# EAGLE design R3Mkr12F_MB (EAGLE 9.0.1)
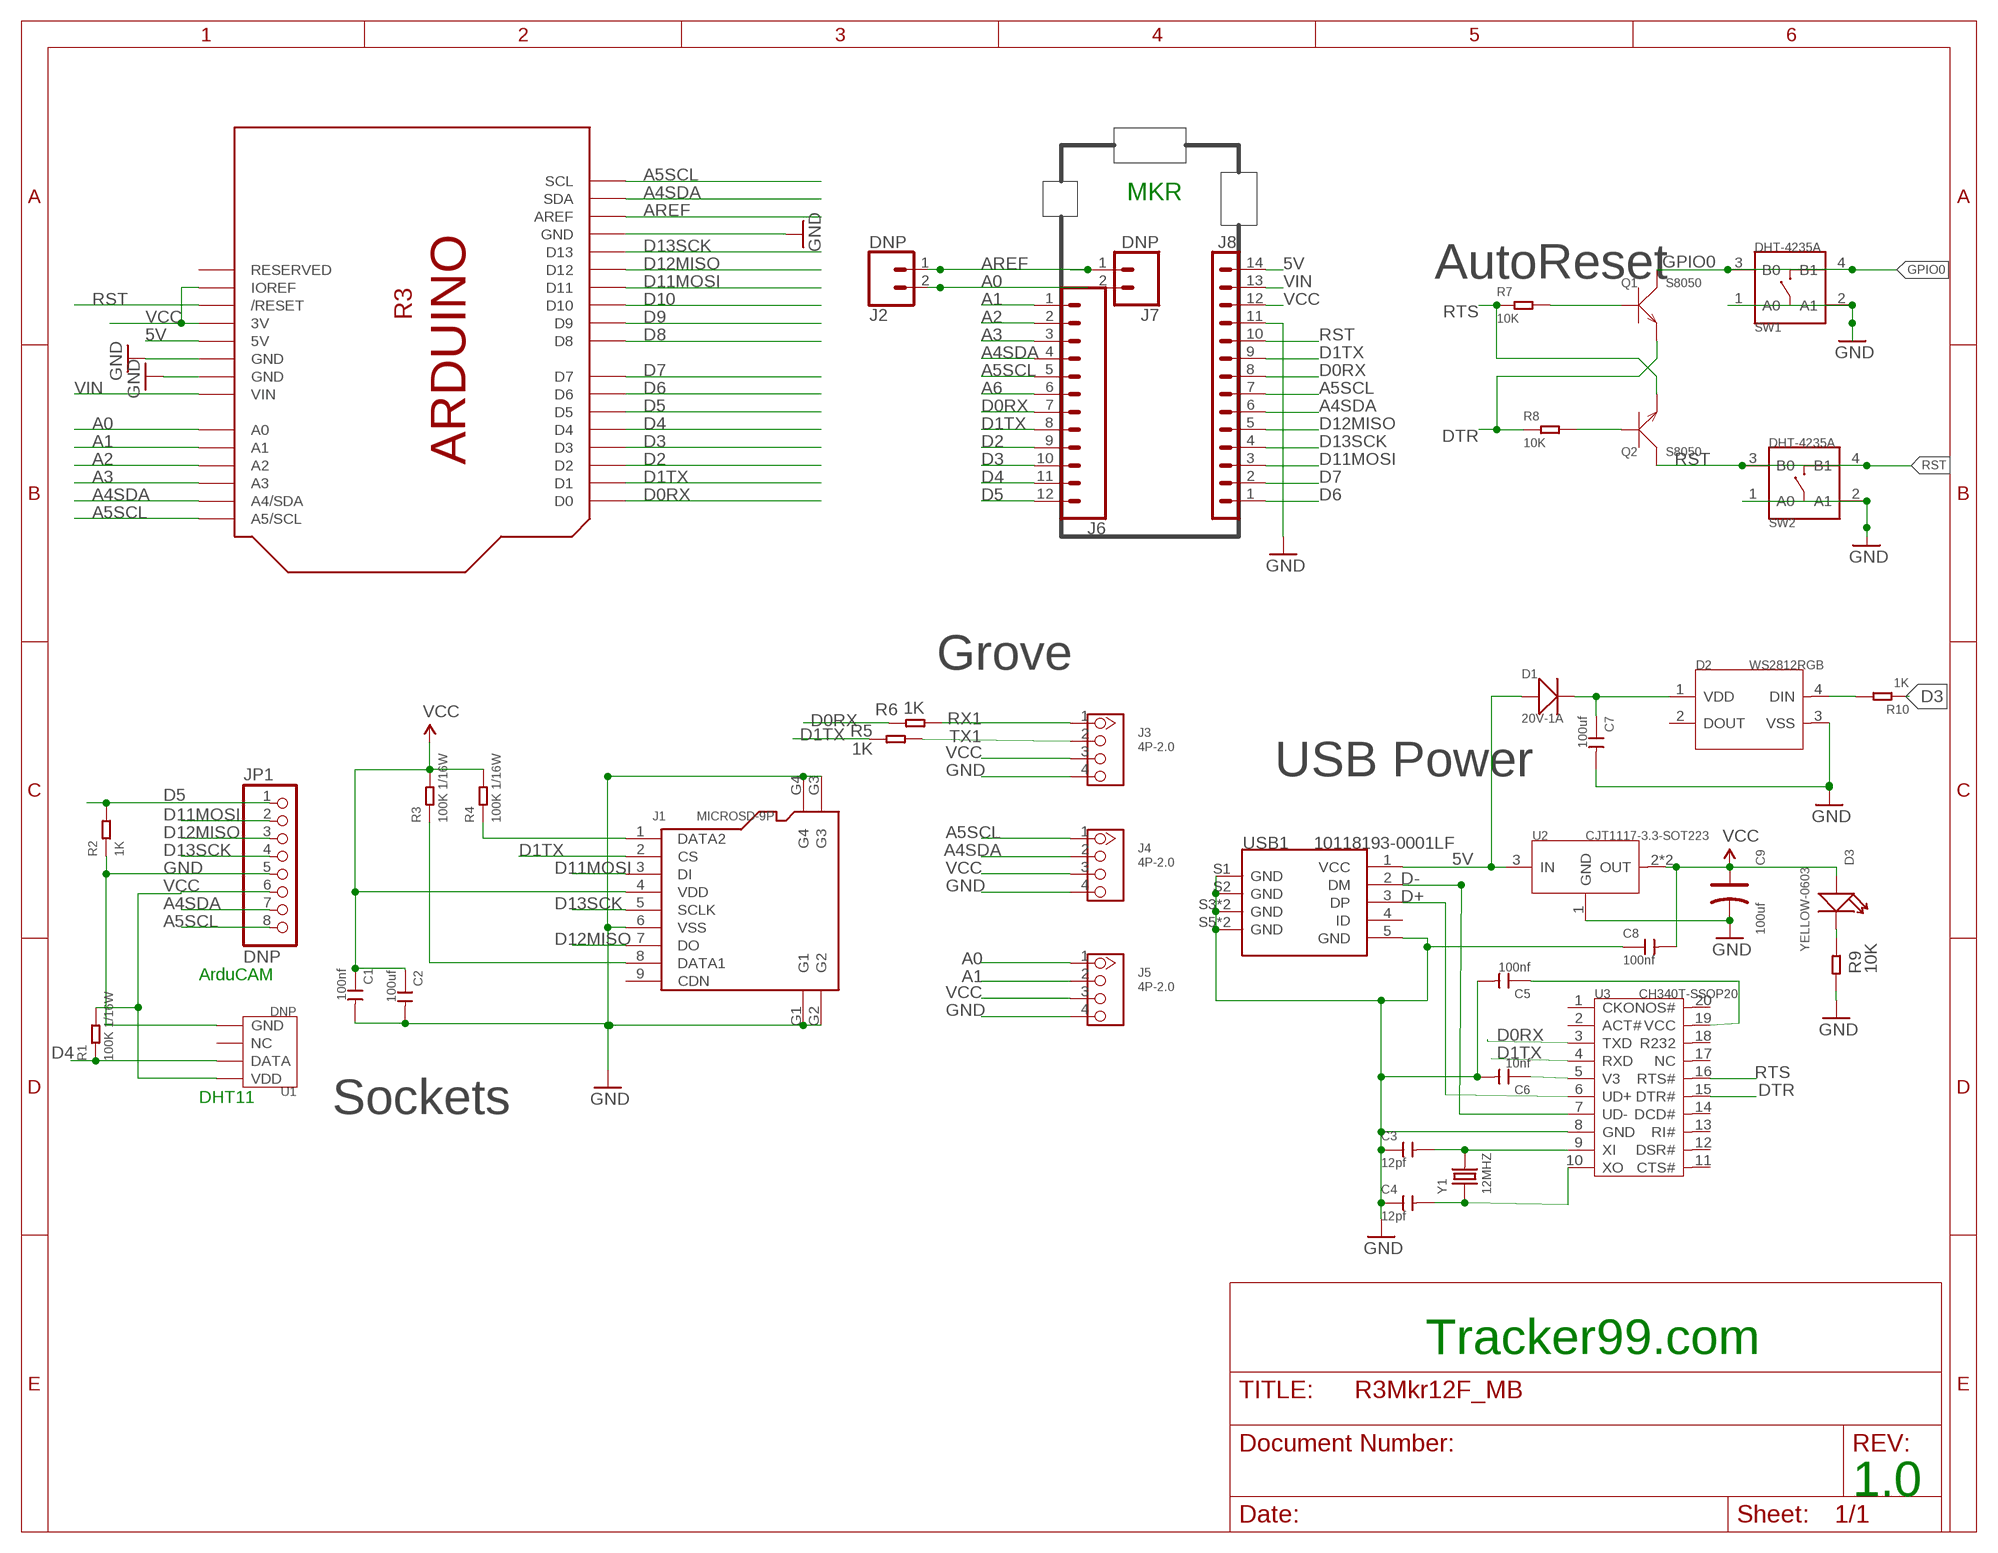
[diagram p0: schematic, sheet 1]

## Parts
C1  100nf  CERAMIC-100NF-50V-10%-X7R(0603)  [C0603]
C2  100uf  CERAMIC-100UF-6.3V-20%-X5R(1206)  [C1206]
C3  12pf  CERAMIC-12PF-50V-5%-NPO(0402)  [C0402]
C4  12pf  CERAMIC-12PF-50V-5%-NPO(0402)  [C0402]
C5  100nf  CERAMIC-100NF-50V-10%-X7R(0603)  [C0603]
C6  10nf  CERAMIC-10NF-50V-10%-X7R(0603)  [C0603]
C7  100uf  CERAMIC-100UF-6.3V-20%-X5R(1206)  [C1206]
C8  100nf  CERAMIC-100NF-50V-10%-X7R(0603)  [C0603]
C9  100uf  TANTALUM-SMD-100UF-10V(AVX-B)  [AVX-B]
D1  20V-1A  SMD-DIODE-SCHOTTKY-20V-1A(SOD-123)  [SOD-123]
D2  WS2812RGB  SMD-RGB-LED-4P'WS2812B'  [LED4-SMD-5050]
D3  YELLOW-0603  SMD-LED-CLEAR-YELLOW(0603)  [LED-0603]
J1  MICROSD-9P  MICRO-SD-CARD-HOLDER-9P  [MICRO-SD9+4P-SMD-16.1X14.5X1.85MM]
J2  DNP  CONN_02  [1X02]
J3  4P-2.0  GROVE-CONNECTOR-DIP(4P-2.0)  [HW4-2.0]
J4  4P-2.0  GROVE-CONNECTOR-DIP(4P-2.0)  [HW4-2.0]
J5  4P-2.0  GROVE-CONNECTOR-DIP(4P-2.0)  [HW4-2.0]
J6  CONN_12LOCK  [1X12_LOCK]
J7  DNP  CONN_02  [1X02]
J8  DNP  STRIP-14STD  [1X14]
JP1  DNP  MILLER_PINHD-1X8LOCK  [MILLER_1X08-LOCK]
Q1  S8050  SMD-TRANSISTORS-NPN-25V-500MW-S8050(SOT-23)  [SOT-23]
Q2  S8050  SMD-TRANSISTORS-NPN-25V-500MW-S8050(SOT-23)  [SOT-23]
R1  100K 1/16W  SMD-RES-100K-5%-1/16W(0402)  [R0402]
R2  1K  SMD-RES-1K-5%-1/8W(0805)  [R0805]
R3  100K 1/16W  SMD-RES-100K-5%-1/16W(0402)  [R0402]
R4  100K 1/16W  SMD-RES-100K-5%-1/16W(0402)  [R0402]
R5  1K  SMD-RES-1K-5%-1/8W(0805)  [R0805]
R6  1K  SMD-RES-1K-5%-1/8W(0805)  [R0805]
R7  10K  SMD-RES-10K-5%-1/(0402)  [R0402]
R8  10K  SMD-RES-10K-5%-1/(0402)  [R0402]
R9  10K  SMD-RES-10K-5%-1/(0402)  [R0402]
R10  1K  SMD-RES-1K-5%-1/8W(0805)  [R0805]
SW1  DHT-4235A  SMD-BUTTON-TOP-DHT-4235A(4P-4.2X3.2MM)  [SW4-SMD-4.2X3.2X2.5MM]
SW2  DHT-4235A  SMD-BUTTON-TOP-DHT-4235A(4P-4.2X3.2MM)  [SW4-SMD-4.2X3.2X2.5MM]
U1  DNP  TEM-HUM-DHT11(4P-15.5X12.0MM)  [SNR4-2.54-15.5X12.0X5.5MM]
U2  CJT1117-3.3-SOT223  PMIC-CJT1117-3.3(SOT223)  [SOT-223]
U3  CH340T-SSOP20  INTERFACE-CH340T(SSOP20)  [SSOP20-0.65-7.6X5.2MM]
UNO1  MKR12FUNO99_ARDUINO_R3_NOICSP_47MM  [MKR12FUNO99_ARDUINOR3_NOICSP_47MM]
USB1  10118193-0001LF  MICRO-USB-SMD-B-(10118193-0001LF)  [MICRO-USB5+6P-SMD-0.65-B]
Y1  12MHZ  SMD-CRYSTAL-12MHZ-20PF-20PPM-40R(2P-5.0X3.2MM)  [X2-SMD-5.0X3.2X1.3MM]

## Nets
5V [power]: D1.+ J8.14 U2.3(IN) UNO1.5V USB1.1(VCC)
A0: J2.2 J5.1 J7.2 UNO1.A0
A1: J5.2 J6.1 UNO1.A1
A2: J6.2 UNO1.A2
A3: J6.3 UNO1.A3
A4SDA: J4.2 J6.4 J8.6 JP1.7 UNO1.A4(A4/SDA) UNO1.SDA
A5SCL: J4.1 J6.5 J8.7 JP1.8 UNO1.A5(A5/SCL) UNO1.SCL
A6: J6.6
AREF: J2.1 J7.1 UNO1.AREF
D0RX: J6.7 J8.8 R6.2 U3.3(TXD) UNO1.D0
D1TX: J1.2(CS) J6.8 J8.9 R5.2 U3.4(RXD) UNO1.D1
D2: J6.9 UNO1.D2
D3: J6.10 R10.1 UNO1.D3
D4: J6.11 R1.1 U1.2(DATA) UNO1.D4
D5: J6.12 JP1.1 R2.2 UNO1.D5
D6: J8.1 UNO1.D6
D7: J8.2 UNO1.D7
D8: UNO1.D8
D9: UNO1.D9
D10: UNO1.D10
D11MOSI: J1.3(DI) J8.3 JP1.2 UNO1.D11
D12MISO: J1.7(DO) J8.5 JP1.3 UNO1.D12
D13SCK: J1.5(SCLK) J8.4 JP1.4 UNO1.D13
D+: U3.6(UD+) USB1.3(DP)
D-: U3.7(UD-) USB1.2(DM)
DTR: Q1.2(E) R8.1 U3.15(DTR#)
GND [power]: C1.2 C2.2 C3.1 C4.1 C5.2 C6.2 C7.2 C8.1 C9.- D2.3(VSS) J1.6(VSS) J1.G1 J1.G2 J1.G3 J1.G4 J3.4 J4.4 J5.4 J8.11 JP1.5 R2.1 R9.1 SW1.1(A0) SW1.2(A1) SW2.1(A0) SW2.2(A1) U1.4(GND) U2.1(GND) U3.8(GND) UNO1.GND UNO1.GND@1(GND) UNO1.GND@2(GND) USB1.5(GND) USB1.S1(GND) USB1.S2(GND) USB1.S3(GND) USB1.S4(GND) USB1.S5(GND) USB1.S6(GND)
GPIO0: Q1.3(C) SW1.3(B0) SW1.4(B1)
N$2 [power]: C3.2 U3.9(XI) Y1.2
N$3 [power]: C4.2 U3.10(XO) Y1.1
N$5: J1.8(DATA1) R3.1
N$6: J1.1(DATA2) R4.1
N$8: D2.4(DIN) R10.2
N$10: Q2.1(B) R8.2
N$11: Q1.1(B) R7.2
N$12: D3.- R9.2
RST: J8.10 Q2.3(C) SW2.3(B0) SW2.4(B1) UNO1.RESET(/RESET)
RTS: Q2.2(E) R7.1 U3.16(RTS#)
RX1: J3.1 R6.1
TX1: J3.2 R5.1
V1 [power]: C7.1 D1.- D2.1(VDD)
V3: C6.1 U3.5(V3)
VCC [power]: C1.1 C2.1 C5.1 C8.2 C9.+ D3.+ J1.4(VDD) J3.3 J4.3 J5.3 J8.12 JP1.6 R1.2 R3.2 R4.2 U1.1(VDD) U2.2(OUT) U2.TER(OUT) U3.19(VCC) UNO1.3V UNO1.IOREF
VIN [power]: J8.13 UNO1.VIN
Unconnected: D2.2(DOUT) J1.9(CDN) U1.3(NC) U3.1(CKO) U3.2(ACT#) U3.11(CTS#) U3.12(DSR#) U3.13(RI#) U3.14(DCD#) U3.17(NC) U3.18(R232) U3.20(NOS#) UNO1.RESERVED USB1.4(ID)

## Notes on the sheet
- MKR
- AutoReset
- Grove
- USB Power
- ArduCAM
- DHT11
- Sockets
- Tracker99.com
- 1.0

## Library data of the parts
C1 C5 C8 = Seeed-Capacitor:CERAMIC-100NF-50V-10%-X7R(0603): 302010138; MPN: CC0603KRX7R9BB104
C2 C7 = Seeed-Capacitor:CERAMIC-100UF-6.3V-20%-X5R(1206): 302010183; MPN: GRM31CR60J107ME39L
C3 C4 = Seeed-Capacitor:CERAMIC-12PF-50V-5%-NPO(0402): 302010049; MPN: CC0402JRNPO9BN120
C6 = Seeed-Capacitor:CERAMIC-10NF-50V-10%-X7R(0603): 302010140; MPN: CC0603KRX7R9BB103
C9 = Seeed-Capacitor:TANTALUM-SMD-100UF-10V(AVX-B): 302020015; MPN: TAJB107M010#NJ
D1 = Seeed-Diode:SMD-DIODE-SCHOTTKY-20V-1A(SOD-123): 304020034; MPN: B5819W
D2 = Seeed-Diode:SMD-RGB-LED-4P: 304990003
D3 = Seeed-LED:SMD-LED-CLEAR-YELLOW(0603): 304090044; MPN: 19-217-Y5C-AM1N1VY-3T
J1 = Seeed-Connector:MICRO-SD-CARD-HOLDER-9P: 320090008
J2 J7 = SparkFun-Connectors:CONN_02: Multi connection point. Often used as Generic Header-pin footprint for 0.1 inch spaced/style header connections On any of the 0.1 inch spaced packages, you can populate with these: Break Away Headers - Straight <https://www.sparkfun.com/products/116> (PRT-00116) Break Away Male Headers - Right Angle <https://www.sparkfun.com/products/553> (PRT-00553) Female Headers <https://www.sparkfun.com/products/115> (PRT-00115) Break Away Headers - Machine Pin <https://www.sparkfun.com/products/117> (PRT-00117) Break Away Female Headers - Swiss Machine Pin <https://www.sparkfun.com/products/743> (PRT-00743) For SCREWTERMINALS and SPRING TERMINALS visit here: Screw Terimnals on SparkFun.com <https://www.sparkfun.com/search/results?term=Screw+Terminals> (5mm/3.5mm/2.54mm spacing) This device is also useful as a general connection point to wire up your design to another part of your project. Our various solder wires solder well into these plated through hole pads. Hook-Up Wire - Assortment (Stranded, 22 AWG) <https://www.sparkfun.com/products/11375> (PRT-11375) Hook-Up Wire - Assortment (Solid Core, 22 AWG) <https://www.sparkfun.com/products/11367> (PRT-11367) View the entire wire category on our website here <https://www.sparkfun.com/categories/141> Special notes: Molex polarized connector foot print use with: PRT-08233 with associated crimp pins and housings. 2.54_SCREWTERM for use with PRT-10571. 3.5mm Screw Terminal footprints for PRT-08084 5mm Screw Terminal footprints for use with PRT-08432
J3-J5 = Seeed-Connector:GROVE-CONNECTOR-DIP(4P-2.0): 320110033
J6 = SparkFun-Connectors:CONN_12: Multi connection point. Often used as Generic Header-pin footprint for 0.1 inch spaced/style header connections On any of the 0.1 inch spaced packages, you can populate with these: Break Away Headers - Straight <https://www.sparkfun.com/products/116> (PRT-00116) Break Away Male Headers - Right Angle <https://www.sparkfun.com/products/553> (PRT-00553) Female Headers <https://www.sparkfun.com/products/115> (PRT-00115) Break Away Headers - Machine Pin <https://www.sparkfun.com/products/117> (PRT-00117) Break Away Female Headers - Swiss Machine Pin <https://www.sparkfun.com/products/743> (PRT-00743) For SCREWTERMINALS and SPRING TERMINALS visit here: Screw Terimnals on SparkFun.com <https://www.sparkfun.com/search/results?term=Screw+Terminals> (5mm/3.5mm/2.54mm spacing) This device is also useful as a general connection point to wire up your design to another part of your project. Our various solder wires solder well into these plated through hole pads. Hook-Up Wire - Assortment (Stranded, 22 AWG) <https://www.sparkfun.com/products/11375> (PRT-11375) Hook-Up Wire - Assortment (Solid Core, 22 AWG) <https://www.sparkfun.com/products/11367> (PRT-11367) View the entire wire category on our website here <https://www.sparkfun.com/categories/141> Special notes: Molex polarized connector foot print use with SKU : PRT-08231 with associated crimp pins and housings. 1MM SMD Version SKU: PRT-10208 NOTES ON THE VARIANTS LOCK and LOCK_LONGPADS... This footprint was designed to help hold the alignment of a through-hole component (i.e. 6-pin header) while soldering it into place. You may notice that each hole has been shifted either up or down by 0.005 of an inch from it's more standard position (which is a perfectly straight line). This slight alteration caused the pins (the squares in the middle) to touch the edges of the holes. Because they are alternating, it causes a "brace" to hold the component in place. 0.005 has proven to be the perfect amount of "off-center" position when using our standard breakaway headers. Although looks a little odd when you look at the bare footprint, once you have a header in there, the alteration is very hard to notice. Also,if you push a header all the way into place, it is covered up entirely on the bottom side.
J8 = Arduino-connectors:STRIP-14
JP1 = MKR12FUNO99:MILLER_PINHD-1X8: PIN HEADER
Q1 Q2 = Seeed-Transistor:SMD-TRANSISTORS-NPN-25V-500MW-S8050(SOT-23): 305010017; MPN: S8050
R1 R3 R4 = Seeed-Resistor:SMD-RES-100K-5%-1/16W(0402): 301010033; MPN: RC0402JR-07100KL
R2 R5 R6 R10 = Seeed-Resistor:SMD-RES-1K-5%-1/8W(0805): 301010311; MPN: RC0805JR-071KL
R7-R9 = Seeed-Resistor:SMD-RES-10K-5%-1/(0402): 301010004; MPN: RC0402JR-0710KL
SW1 SW2 = Seeed-Switch:SMD-BUTTON-TOP-DHT-4235A(4P-4.2X3.2MM): 311020045; MPN: DHT-4235A
U1 = Seeed-Sensor:TEM-HUM-DHT11(4P-15.5X12.0MM): 314010000; MPN: DHT11; VALUE: DHT11
U2 = Seeed-IC:PMIC-CJT1117-3.3(SOT223): 310030097; MPN: CJT1117-3.3
U3 = Seeed-IC:INTERFACE-CH340T(SSOP20): 310070026; MPN: CH340T
UNO1 = R3Mkr12F_MB:MKR12FUNO99_ARDUINO_R3_NOICSP_47MM: Arduino R3 NoICSP 49mm
USB1 = Seeed-Connector:MICRO-USB-SMD-B-(10118193-0001LF): 320010003; MPN: 10118193-0001LF
Y1 = Seeed-Crystal Oscillator:SMD-CRYSTAL-12MHZ-20PF-20PPM-40R(2P-5.0X3.2MM): 306010047; MPN: 5032/2P

## Net classes
0 default: width 0.152 mm, drill 0.305 mm, clearance 0.152 mm
1 power: width 0.356 mm, clearance 0.203 mm

## Board
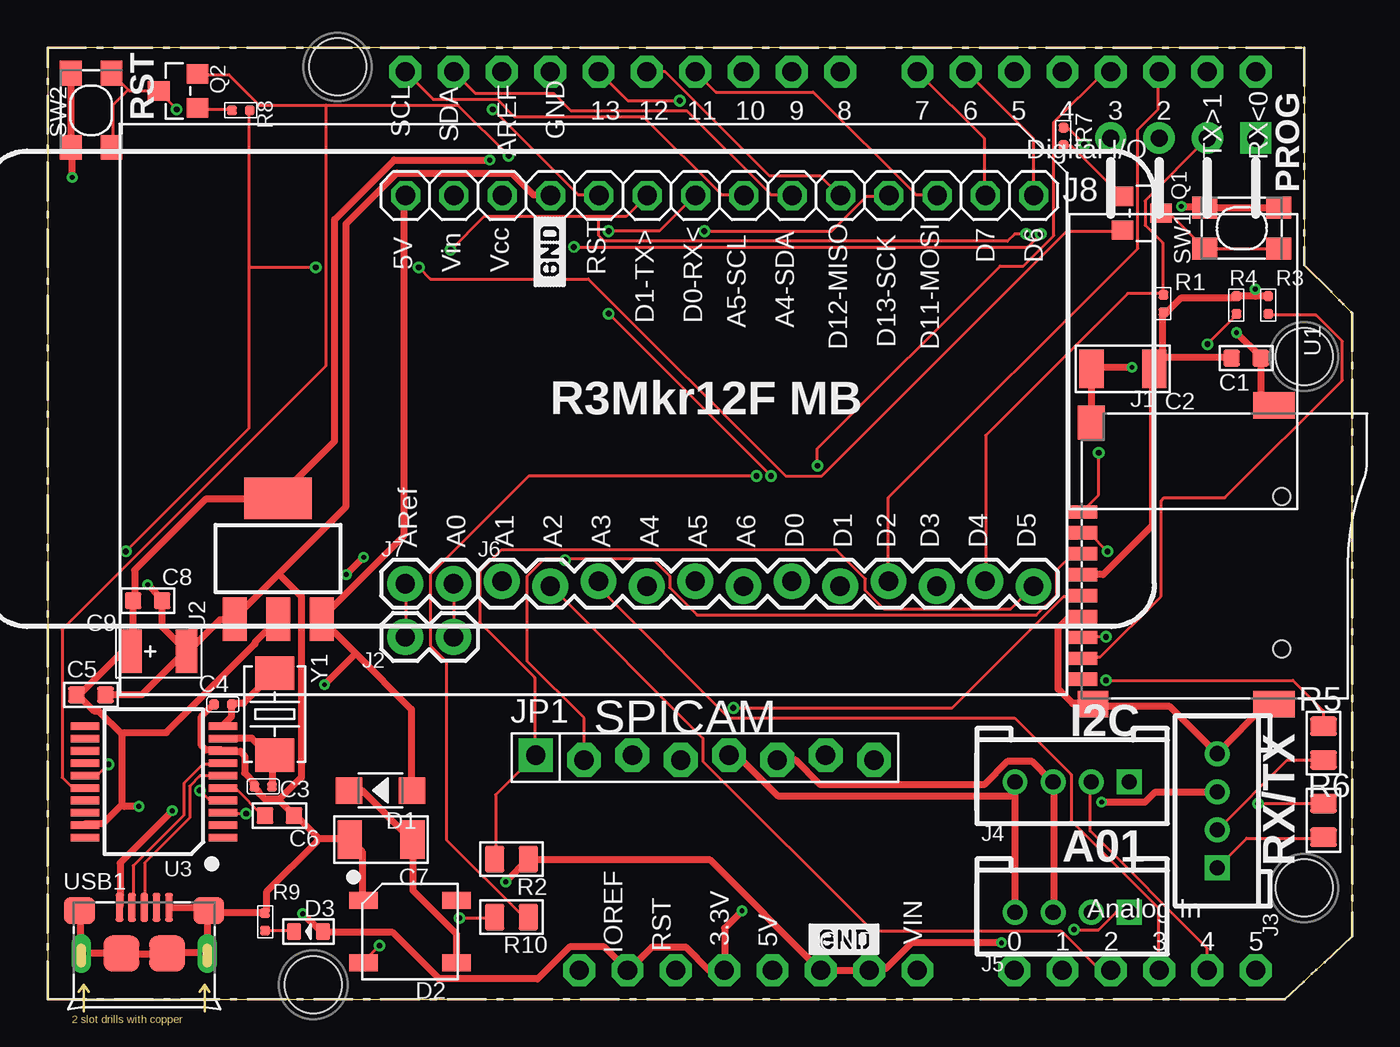
[diagram p1: board, top side]
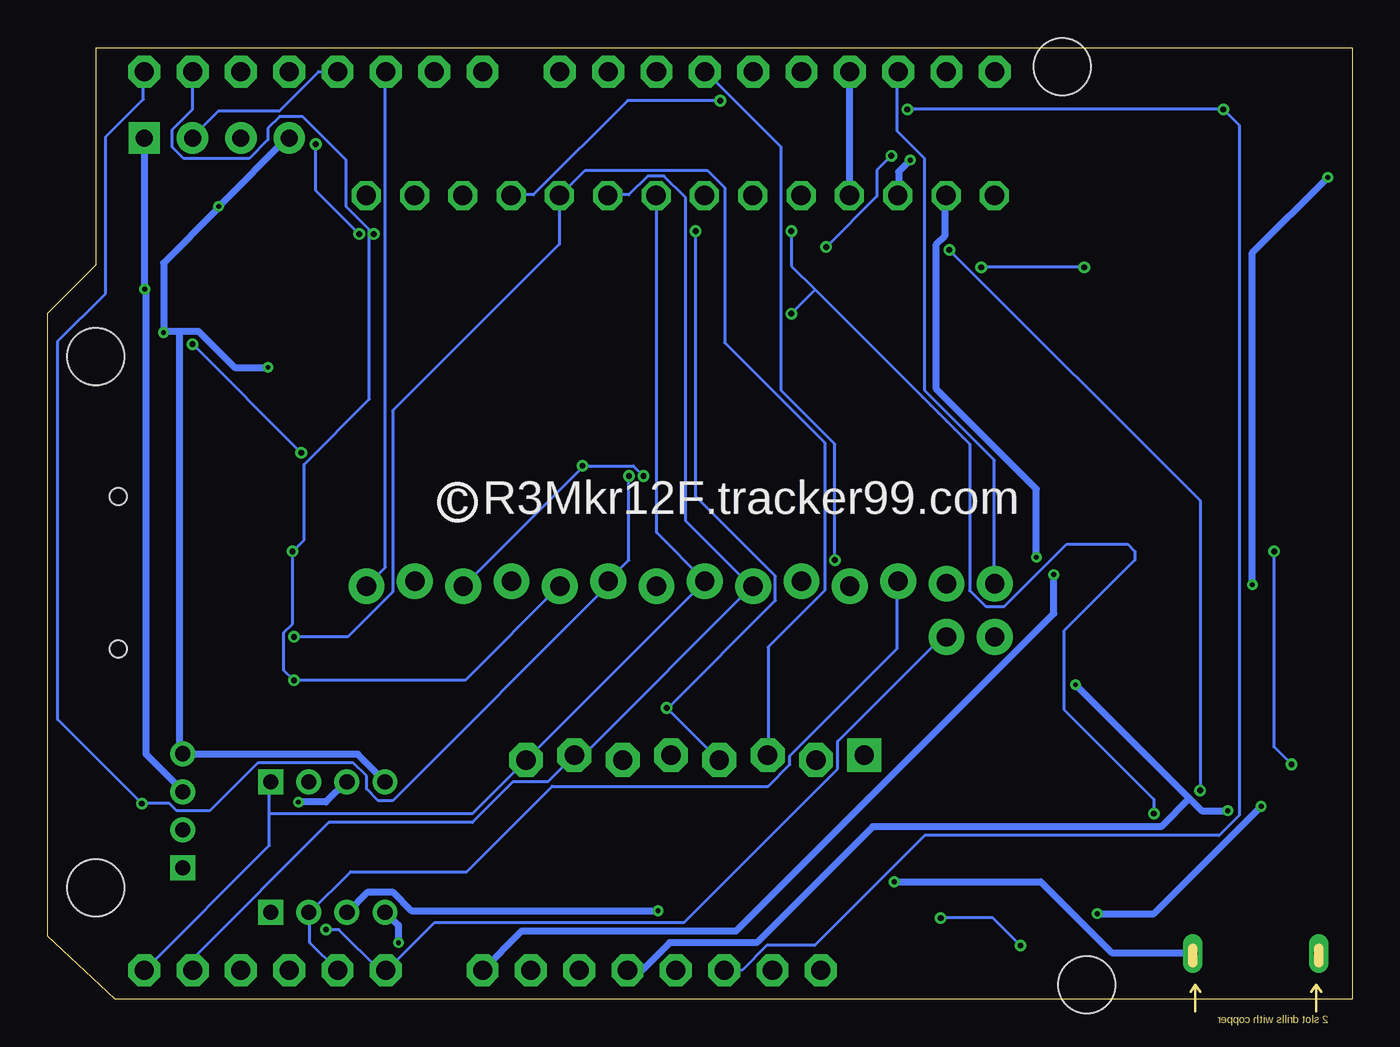
[diagram p2: board, bottom side, seen from below]

Size 68.58 x 50.04 mm. Coordinates in mm from the lower left corner, seen from the top.
Outline: 0,0 65.02,0 68.58,3.3 68.58,36.07 66.04,38.61 66.04,50.04 0,50.04 0,0
Copper layers (1*16): Top 0.035mm / dielectric 1.5mm / Bottom 0.035mm
Design rules "SeeedStudio_2layers *": minimum track width 6mil, minimum drill 10mil, track to track 6mil, track to pad 6mil, pad to pad 6mil, via to via 6mil, smd to smd 0mil, copper to edge 16mil, drill to drill 10mil, minimum pad ring 10mil, minimum via ring 6mil, stop-mask expansion 2mil, vias tented up to drill 100mil, thermal gap 10mil
tRestrict: area 0,22.6 to 3.8,40.4
bRestrict: area 0,22.4 to 3.8,40.4

### Footprints (pad centres in the part's own frame; a part is rotated, then mirrored left to right if it is on the bottom)
C0603 = smd 0.889 x 0.889: 1 0,0.762; 2 0,-0.762
C1206 = smd 1.27 x 2.032: 1 -1.651,0; 2 1.651,0
C0402 = smd 0.5 x 0.5: 1 0,0.463; 2 0,-0.463
AVX-B = smd 1.143 x 2.286: + -1.46,0; - 1.46,0
SOD-123 = smd 1.397 x 1.397: + -1.651,0; - 1.651,0
LED4-SMD-5050 = smd 1.5 x 0.9: 1 -2.45,1.65; 2 -2.45,-1.65; 3 2.45,-1.65; 4 2.45,1.65
LED-0603 = smd 0.762 x 0.889: + -0.762,0; - 0.762,0
MICRO-SD9+4P-SMD-16.1X14.5X1.85MM = smd 1.6 x 0.7: 1 0,2.25; 2 0,1.15; 3 0,0.05; 4 0,-1.05; 5 0,-2.15; 6 0,-3.25; 7 0,-4.35; 8 0,-5.45; 9 0,-6.55 | smd 1.6 x 1.4: G1 0.6,-7.85 | smd 2.2 x 1.4: G2 10.1,-7.85; G3 10.1,7.85 | smd 1.4 x 1.8: G4 0.5,6.95 | hole 0.9: 10.5,-4.95; 10.5,3.05
1X02 = drill 1.016 pad 1.88: 1 0,0; 2 2.54,0
HW4-2.0 = drill 0.8 pad 1.27 square: 1 -3,0 | drill 0.8 pad 1.27: 2 -1,0; 3 1,0; 4 3,0
1X12_LOCK = drill 1.016 pad 1.88: 1 0,0.127; 2 2.54,-0.127; 3 5.08,0.127; 4 7.62,-0.127; 5 10.16,0.127; 6 12.7,-0.127; 7 15.24,0.127; 8 17.78,-0.127; 9 20.32,0.127; 10 22.86,-0.127; 11 25.4,0.127; 12 27.94,-0.127
1X14 = drill 1.016 octagon: 1 -16.51,0; 2 -13.97,0; 3 -11.43,0; 4 -8.89,0; 5 -6.35,0; 6 -3.81,0; 7 -1.27,0; 8 1.27,0; 9 3.81,0; 10 6.35,0; 11 8.89,0; 12 11.43,0; 13 13.97,0; 14 16.51,0
MILLER_1X08-LOCK = drill 1.016 pad 1.778 square: 1 -8.89,0.127 | drill 1.016 pad 1.778 octagon: 2 -6.35,-0.127; 3 -3.81,0.127; 4 -1.27,-0.127; 5 1.27,0.127; 6 3.81,-0.127; 7 6.35,0.127; 8 8.89,-0.127
SOT-23 = smd 1.016 x 1.143: 1 -0.889,-1.016; 2 0.889,-1.016; 3 0,1.016
R0402 = smd 0.5 x 0.5: 1 0,0.463; 2 0,-0.463
R0805 = smd 1.397 x 1.016: 1 0,0.889; 2 0,-0.889
SW4-SMD-4.2X3.2X2.5MM = smd 1.3 x 1.15: 1 -1.95,1.075; 2 1.95,1.075; 3 -1.95,-1.075; 4 1.95,-1.075
SNR4-2.54-15.5X12.0X5.5MM = drill 0.889 pad 1.651 square: 1 -11.75,3.81 | drill 0.889 pad 1.651: 2 -11.75,1.27; 3 -11.75,-1.27; 4 -11.75,-3.81
SOT-223 = smd 1.27 x 2.286: 1 -2.286,-3.175; 2 0,-3.175; 3 2.286,-3.175 | smd 3.556 x 2.159: TER 0,3.175
SSOP20-0.65-7.6X5.2MM = smd 0.4 x 1.5: 1 -2.925,-3.625; 2 -2.275,-3.625; 3 -1.625,-3.625; 4 -0.975,-3.625; 5 -0.325,-3.625; 6 0.325,-3.625; 7 0.975,-3.625; 8 1.625,-3.625; 9 2.275,-3.625; 10 2.925,-3.625; 11 2.925,3.625; 12 2.275,3.625; 13 1.625,3.625; 14 0.975,3.625; 15 0.325,3.625; 16 -0.325,3.625; 17 -0.975,3.625; 18 -1.625,3.625; 19 -2.275,3.625; 20 -2.925,3.625
MKR12FUNO99_ARDUINOR3_NOICSP_47MM = drill 1 pad 1.676 octagon: 3V 35.56,3.302; 5V 38.1,3.302; A0 50.8,3.302; A1 53.34,3.302; A2 55.88,3.302; A3 58.42,3.302; A4 60.96,3.302; A5 63.5,3.302; AREF 23.876,50.546; D0 63.5,50.546; D1 60.96,50.546; D2 58.42,50.546; D3 55.88,50.546; D4 53.34,50.546; D5 50.8,50.546; D6 48.26,50.546; D7 45.72,50.546; D8 41.656,50.546; D9 39.116,50.546; D10 36.576,50.546; D11 34.036,50.546; D12 31.496,50.546; D13 28.956,50.546; GND 26.416,50.546; GND@1 43.18,3.302; GND@2 40.64,3.302; IOREF 30.48,3.302; RESERVED 27.94,3.302; RESET 33.02,3.302; SCL 18.796,50.546; SDA 21.336,50.546; VIN 45.72,3.302 | hole 3: 15.24,50.8; 13.97,2.54; 66.04,7.62; 66.04,35.56
MICRO-USB5+6P-SMD-0.65-B = smd 0.4 x 1.5: 1 -1.3,-0.25; 2 -0.65,-0.25; 3 0,-0.25; 4 0.65,-0.25; 5 1.3,-0.25 | smd 1.6 x 1.4: S1 -3.4,-0.427; S6 3.4,-0.427 | drill 0.508 pad 1.016 long: S2 -3.3,-2.675; S5 3.3,-2.675 | smd 1.9 x 1.9: S3 -1.2,-2.675; S4 1.2,-2.675
X2-SMD-5.0X3.2X1.3MM = smd 1.778 x 2.032: 1 -2.159,0; 2 2.159,0

### Placement (x,y rotation side)
C1  62.99,33.71 90 top
C2  56.52,33.15 180 top
C3  11.34,11.18 90 top
C4  9.22,15.49 90 top
C5  2.29,16 90 top
C6  12.19,9.65 90 top
C7  17.53,8.38 180 top
C8  5.26,20.95 270 top
C9  5.84,18.29 0 top
D1  17.5,10.97 180 top
D2  19.05,3.56 180 top
D3  13.72,3.56 180 top
J1  54.36,23.37 0 top
J2  18.8,19.05 0 top
J3  61.47,9.91 90 top
J4  53.85,11.43 180 top
J5  53.85,4.57 180 top
J6  23.88,21.84 0 top
J7  18.8,21.84 0 top
J8  35.32,42.26 180 top
JP1  34.54,12.7 0 top
Q1  57.51,41.33 270 top
Q2  6.86,47.75 90 top
R1  58.65,36.58 0 top
R2  24.38,7.37 270 top
R3  64.16,36.5 180 top
R4  62.48,36.5 180 top
R5  67.06,13.46 180 top
R6  67.06,9.4 180 top
R7  53.39,45.36 0 top
R8  10.16,46.74 270 top
R9  11.43,4.06 0 top
R10  24.38,4.32 270 top
SW1  62.76,40.54 0 top
SW2  2.29,46.74 90 top
U1  59.69,33.53 270 top
U2  12.12,23.16 0 top
U3  5.59,11.43 90 top
UNO1  0,-1.78 0 top
USB1  5.08,5.08 0 top
Y1  11.94,14.99 270 top

### Tracks (layer width: path | path; a pad name or v marks a point on that pad's centre or on a via)
5V  (via drill 0.25)
  Top 0.356: 16.19,18.17 14.4,19.96 U2.3 14.48,20.12 18.75,24.38 18.75,42.22 J8.14 | 16.19,18.17 19.13,15.24 19.13,10.97 D1.+ | v6.55,9.91 3.81,7.16 3.81,4.88 USB1.1 | 16.19,18.17 v14.55,16.54
  Bottom 0.356: v6.55,9.91 7.92,9.91 8.57,10.55 | v14.55,16.54 8.57,10.55 | UNO1.5V 37.34,1.52 35.89,2.97 31.32,2.97 25.22,9.07 10.06,9.07 8.57,10.55
A0  (via drill 0.3)
  Top 0.152: J7.2 J2.2 | J5.1 56.16,4.57 55.24,3.66 v53.95,3.66
  Bottom 0.152: v53.95,3.66 53.26,3.66 51.13,1.52 UNO1.A0 50.75,1.52 48.23,4.04 35.13,4.04 27.05,12.12 27.05,13.56 21.57,19.05 J2.2
A1
  Bottom 0.152: 54.79,4.57 54.79,2.97 UNO1.A1 | 54.79,4.57 52.65,6.71 46.56,6.71 42.06,11.2 30.71,11.2 29.57,12.34 29.57,12.8 23.93,18.44 23.93,21.95 J6.1 | 54.79,4.57 J5.2
A2
  Top 0.152: UNO1.A2 55.32,1.52 53.26,3.58 43.36,3.58 34.44,12.5 34.44,13.72 26.44,21.72 J6.2
A3
  Top 0.152: J6.3 28.96,21.64 35.81,14.78 50.83,14.78 53.8,11.81 53.8,9.37 58.37,4.8 58.37,1.52 UNO1.A3
A4SDA
  Top 0.152: UNO1.SDA 22.48,47.62 26.59,47.62 27.51,46.71 33.6,46.71 38.02,42.29 39.09,42.29 J8.6 | UNO1.A4 60.96,2.67 54.79,8.84 54.79,11.43 J4.2
  Bottom 0.152: UNO1.A4 60.96,2.13 53.8,9.3 46.25,9.3 44.12,11.43 42.29,11.43 JP1.7 40.84,12.88 40.39,12.88 31.55,21.72 J6.4 31.62,21.72 35.05,25.15 35.05,42.14 36.2,43.28 37.03,43.28 38.02,42.29 39.09,42.29 J8.6
A5SCL
  Top 0.152: J8.7 36.58,42.29 35.43,42.29 31.32,46.41 24.54,46.41 23.62,47.32 20.27,47.32 18.82,48.77 UNO1.SCL
  Bottom 0.152: 56.92,9.75 56.92,8.08 63.48,1.52 UNO1.A5 | 56.92,9.75 56.92,11.43 J4.1 | 56.92,9.75 46.25,9.75 JP1.8 J6.5 34.06,22.02 36.58,24.54 36.58,42.22 J8.7
AREF
  Top 0.152: J2.1 18.82,19.05 18.82,21.79 J7.1
  Bottom 0.152: UNO1.AREF 23.93,48.77 23.93,45.64 22.48,44.2 22.48,32 18.82,28.35 18.82,21.87 J7.1
D0RX  (via drill 0.3)
  Top 0.152: v10.44,9.75 9.22,9.75 U3.3 | v29.49,40.39 32.16,40.39 33.98,42.22 J8.8 | v63.63,10.29 R6.2 | v38.02,27.51 v29.49,36.04
  Bottom 0.152: v10.44,9.75 10.44,10.52 15.16,15.24 15.16,19.36 11.43,23.09 11.43,23.55 11.81,23.93 15.01,23.93 18.29,20.65 19.28,20.65 20.12,21.49 20.12,29.18 28.23,37.3 | 28.23,37.3 29.49,38.56 v29.49,40.39 | UNO1.D0 63.55,48.77 63.55,47.32 65.53,45.34 65.53,37.11 68.05,34.59 68.05,14.71 v63.63,10.29 62.18,10.29 61.8,9.91 60.05,9.91 57.53,12.42 52.5,12.42 51.82,11.73 51.82,11.05 51.21,10.44 50.44,10.44 39.17,21.72 39.17,21.95 J6.7 39.09,22.02 38.02,23.09 v38.02,27.51 | v29.49,36.04 28.23,37.3
D1TX  (via drill 0.3)
  Top 0.152: v8,10.97 8.46,10.52 9.14,10.52 U3.4 | v21.18,39.4 22.94,41.15 28.96,41.15 | 28.96,41.15 30.4,41.15 31.47,42.22 J8.9 | R5.2 67.06,15.16 65.46,16.76 v55.63,16.76 | v55.7,23.55 54.79,24.46 54.41,24.46 J1.2 | 28.96,41.15 28.96,40.16 29.26,39.85 50.44,39.85 50.83,40.23 v51.44,40.23
  Bottom 0.152: v8,10.97 8,26.21 v21.18,39.4 | J6.8 41.68,21.72 46.63,16.76 v55.63,16.76 56.16,17.3 56.16,19.28 55.7,19.74 v55.7,23.55 55.09,24.16 55.09,28.12 51.66,31.55 51.66,40.23 | UNO1.D1 60.96,46.79 62.03,45.72 62.03,44.81 61.42,44.2 57.99,44.2 57,45.19 57,45.8 56.39,46.41 55.17,46.41 52.88,44.12 52.88,41.68 51.66,40.46 51.66,40.23 | 51.66,40.23 v51.44,40.23
D2
  Top 0.152: J6.9 44.2,26.36 57.3,39.47 57.3,45.72 58.37,46.79 58.37,48.77 UNO1.D2
D3  (via drill 0.3)
  Top 0.152: v37.26,27.51 25.3,27.51 20.12,22.33 20.12,18.59 20.95,17.75 20.95,8.38 24.99,4.34 25.22,4.34 R10.1 | UNO1.D3 55.55,48.77 52.88,46.1 52.88,40.16 51.28,38.56 50.06,38.56 40.46,28.96 v40.46,28.04
  Bottom 0.152: v37.26,27.51 37.8,28.04 40.39,28.04 40.42,28 | 40.42,28 46.71,21.72 J6.10 | v40.46,28.04 40.42,28
D4
  Top 0.152: U1.2 60.96,45.26 57.68,41.99 57.68,40.69 58.6,39.78 58.6,37.11 R1.1 58.52,37.11 56.77,37.11 49.3,29.64 49.3,22.02 J6.11
  Bottom 0.152: UNO1.D4 54.33,48.77 56.39,46.71 59.59,46.71 60.96,45.34 U1.2
D5
  Top 0.152: R2.2 23.55,7.39 23.55,10.74 25.6,12.8 JP1.1 25.6,12.88 25.6,16.92 22.71,19.81 22.71,22.48 23.85,23.62 41.45,23.62 42.98,22.1 42.98,21.49 43.97,20.5 50.6,20.5 J6.12
  Bottom 0.152: J6.12 50.83,22.71 50.83,48.77 UNO1.D5
D6
  Top 0.152: J8.1 51.82,42.29 51.82,45.26 48.31,48.77 UNO1.D6
D7
  Top 0.152: UNO1.D7 49.23,45.26 49.23,42.29 J8.2
D11MOSI  (via drill 0.3)
  Top 0.152: J8.3 46.71,42.29 45.64,42.29 40.23,47.7 35.13,47.7 34.06,48.77 UNO1.D11 | 27.2,23.16 26.14,23.16 25.22,22.25 25.22,17.75 28.19,14.78 JP1.2 | 27.2,23.16 31.77,23.16 32.69,22.25 32.69,21.64 34.14,20.19 51.97,20.19 53.03,21.26 53.03,22.55 53.87,23.39 54.33,23.39 J1.3 | 27.2,23.16 v27.2,23.09
  Bottom 0.152: v27.2,23.09 27.2,29.18 30.02,32 30.02,44.81 33.98,48.77 UNO1.D11
D12MISO  (via drill 0.3)
  Top 0.152: v55.63,19.05 54.41,19.05 J1.7 | UNO1.D12 32.46,48.77 37.95,43.28 40.62,43.28 41.6,42.29 J8.5
  Bottom 0.152: v55.63,19.05 52.81,19.05 50.44,21.41 50.44,30.94 41.68,39.7 41.68,42.22 J8.5 41.6,42.29 40.31,43.59 33.91,43.59 32.99,42.67 32.99,34.52 27.74,29.26 27.74,21.49 30.71,18.52 30.71,12.88 JP1.3
D13SCK  (via drill 0.3)
  Top 0.152: v33.22,47.24 30.48,47.24 UNO1.D13 | v36.04,15.32 47.55,15.32 53.42,21.18 54.33,21.18 J1.5 | v34.52,40.39 41.22,40.39 43.05,42.22 44.2,42.22 J8.4
  Bottom 0.152: v33.22,47.24 38.1,47.24 43.05,42.29 44.2,42.29 J8.4 | JP1.4 33.3,12.57 v36.04,15.32 35.97,15.32 30.33,20.95 30.33,22.25 34.52,26.44 v34.52,40.39
D+
  Top 0.152: USB1.3 5.11,4.88 5.11,7.16 7.47,9.53 7.47,11.2 8,11.73 9.14,11.73 U3.6
D-
  Top 0.152: USB1.2 4.5,4.88 4.5,7.01 7.16,9.68 7.16,11.35 8.15,12.34 9.14,12.34 U3.7
DTR  (via drill 0.3)
  Top 0.152: 10.59,38.48 10.59,30.02 v4.12,23.55 | 10.59,38.48 10.59,46.71 R8.1 | v3.2,12.34 2.67,11.81 1.98,11.81 U3.15 | v19.51,38.48 20.12,37.87 28.42,37.87 38.79,27.51 40.69,27.51 53.57,40.39 56.46,40.39 Q1.2 | 10.59,38.48 v14.1,38.48
  Bottom 0.152: v4.12,23.55 4.12,13.26 v3.2,12.34 | v14.1,38.48 v19.51,38.48
GND  (via drill 0.25)
  Top 0.356: USB1.S1 1.75,4.65 1.75,2.44 USB1.S2 1.91,2.44 3.81,2.44 USB1.S3 4.04,2.36 6.1,2.36 USB1.S4 6.33,2.44 8.31,2.44 USB1.S5 8.38,2.59 8.38,4.5 USB1.S6 | USB1.S6 8.53,4.65 8.61,4.57 11.43,4.57 R9.1 11.51,4.72 11.51,5.64 14.17,8.31 14.25,8.46 | USB1.5 6.4,4.8 8.38,4.8 USB1.S6 | D2.3 16.54,5.26 16.54,7.77 15.93,8.38 C7.2 15.77,8.46 14.25,8.46 | 12.12,10.52 11.43,10.52 11.12,10.82 11.12,10.9 10.9,11.12 C3.1 10.9,11.35 10.36,11.89 10.36,12.8 10.13,13.03 9.37,13.03 U3.8 9.14,13.11 8.31,13.11 8.08,13.34 8.08,14.86 8.69,15.47 C4.1 | 12.12,10.52 12.95,9.68 C6.2 13.11,9.6 14.25,8.46 | SW2.2 1.22,48.62 1.22,44.81 SW2.1 1.29,44.65 v1.29,43.2 | C5.2 4.95,16 7.24,18.29 C9.- | C9.- 7.16,18.44 6.02,19.58 C8.1 5.94,21.11 v5.26,21.79 | C9.- 7.47,18.36 9.07,19.96 9.83,19.96 U2.1 9.91,20.12 12.15,22.36 | 12.15,22.36 15.7,25.91 15.7,40.77 18.36,43.43 24.38,43.43 25.53,42.29 26.36,42.29 J8.11 | 12.15,22.36 13.34,21.18 13.34,11.66 12.27,10.59 12.12,10.52 | J1.G4 C2.2 55.02,33.22 v57,33.22 | J1.G3 64.39,31.24 63.78,31.85 63.78,33.68 C1.2 63.7,33.83 v62.48,35.05 | SW1.2 64.69,41.6 60.88,41.6 SW1.1 60.66,41.68 v59.59,41.68 | J1.6 54.33,20.12 53.72,20.12 53.11,19.51 53.11,16.31 53.87,15.54 54.94,15.54 J1.G1 55.09,15.39 58.98,15.39 61.34,13.03 J3.4 61.49,12.95 64.01,15.47 64.39,15.47 J1.G2 | 50.83,10.67 50.83,11.43 J4.4 | 50.83,10.67 50.83,4.57 J5.4 | 50.83,10.67 38.41,10.67 36.27,12.8 35.81,12.8 JP1.5 | v50.14,2.97 45.41,2.97 44.04,1.6 43.28,1.6 UNO1.GND@1 UNO1.GND@2 40.62,1.52 34.82,7.32 25.3,7.32 R2.1 v24.08,6.17
  Bottom 0.356: J8.11 26.44,42.29 26.44,48.77 UNO1.GND | v1.29,43.2 5.26,39.24 v5.26,21.79 | U1.4 55.93,45.34 v59.59,41.68 59.66,41.53 62.48,38.71 v62.48,35.05 62.33,35.13 61.65,35.13 | v57,33.22 58.75,33.22 60.66,35.13 61.65,35.13 | J4.4 50.83,11.43 52.27,12.88 61.42,12.88 J3.4 61.57,13.03 61.65,13.11 61.65,35.13 | v50.14,2.97 50.14,3.89 50.83,4.57 J5.4 | v24.08,6.17 16.38,6.17 12.65,2.44 8.38,2.44 USB1.S5
GPIO0
  Top 0.152: Q1.3 58.52,41.3 58.98,41.3 60.81,39.47 SW1.3 60.88,39.47 64.69,39.47 SW1.4
N$2
  Top 0.356: C3.2 11.81,11.2 11.81,12.72 11.89,12.8 Y1.2 11.66,12.8 10.74,13.72 U3.9
N$3
  Top 0.356: U3.10 9.22,14.4 9.68,14.86 9.68,15.47 C4.2 9.83,15.54 10.29,15.54 11.89,17.14 Y1.1
N$5
  Top 0.152: R3.1 64.16,35.97 66.67,35.97 68.05,34.59 68.05,32.54 61.87,26.36 58.67,26.36 58.52,26.21 58.52,21.18 55.32,17.98 54.41,17.98 J1.8
N$6  (via drill 0.3)
  Top 0.152: v60.96,34.44 62.48,35.97 R4.1 | v55.24,28.73 55.24,26.52 54.41,25.68 J1.1
  Bottom 0.152: v55.24,28.73 v60.96,34.44
N$8  (via drill 0.3)
  Top 0.152: v21.64,4.27 23.47,4.27 R10.2 | v17.45,2.82 16.61,1.98 D2.4
  Bottom 0.152: v21.64,4.27 18.9,4.27 v17.45,2.82
N$10
  Top 0.152: R8.2 9.68,46.79 8,46.79 7.92,46.86 Q2.1
N$11
  Top 0.152: R7.2 53.42,44.88 53.8,44.88 56.46,42.22 Q1.1
N$12
  Top 0.152: R9.2 11.43,3.58 12.95,3.58 D3.-
RST  (via drill 0.3)
  Top 0.152: 4.23,47.82 3.43,48.62 SW2.4 | 4.23,47.82 4.27,47.78 5.79,47.78 Q2.3 5.87,47.7 v6.78,46.79 | 4.23,47.82 3.43,47.02 3.43,44.81 SW2.3 | v23.39,46.79 27.89,42.29 28.96,42.29 J8.10
  Bottom 0.152: v23.39,46.79 v6.78,46.79 5.94,45.95 5.94,9.68 7.01,8.61 22.48,8.61 28.27,2.82 30.79,2.82 32.08,1.52 UNO1.RESET
RTS  (via drill 0.3)
  Top 0.152: v54.48,44.96 53.65,45.8 53.42,45.8 R7.1 | v52.2,40.23 51.51,39.55 v27.66,39.55 | v24.23,44.35 21.57,47.02 14.63,47.02 | 14.63,47.02 11.12,47.02 9.53,48.62 7.92,48.62 Q2.2 | 14.63,47.02 14.63,33.3 0.76,19.43 0.76,11.66 1.29,11.12 1.91,11.12 U3.16
  Bottom 0.152: v54.48,44.96 54.48,42.52 v52.2,40.23 | v27.66,39.55 24.99,42.22 24.99,43.59 v24.23,44.35
RX1
  Top 0.152: R6.1 67.06,8.46 63.02,8.46 61.49,6.93 J3.1
TX1
  Top 0.152: R5.1 65.15,12.57 61.49,8.91 J3.2
V1
  Top 0.356: D1.- 16.54,10.97 19.13,8.38 C7.1 19.2,8.23 19.2,5.71 21.49,3.43 21.49,1.98 D2.1
V3
  Top 0.152: C6.1 11.43,9.68 11.28,9.68 9.91,11.05 9.22,11.05 U3.5
VCC  (via drill 0.25)
  Top 0.356: 3.89,10.21 2.9,9.22 1.98,9.22 U3.19 | 3.89,13.95 3.89,10.21 | 3.89,13.95 2.67,15.16 2.44,15.16 1.75,15.85 C5.1 1.68,16 3.96,18.29 C9.+ 4.5,18.36 C8.2 4.57,21.11 4.57,22.55 8.31,26.29 11.96,26.29 U2.TER 12.12,26.36 15.09,29.34 15.09,41 18.21,44.12 v23.24,44.12 | U2.2 12.12,19.96 10.9,18.75 10.9,18.67 6.25,14.02 4.04,14.02 3.89,13.95 | 63.48,36.96 R3.2 | 63.48,36.96 R4.2 62.33,36.88 59.59,36.88 58.83,36.12 R1.2 58.6,36.04 58.6,33.53 58.22,33.15 C2.1 | C1.1 62.18,33.76 58.75,33.76 C2.1 | J1.4 54.41,22.33 55.47,22.33 58.06,24.92 58.06,33.07 C2.1 | 63.48,36.96 v63.48,37.34 | J5.3 52.88,4.57 52.88,11.43 J4.3 52.73,11.51 51.74,12.5 50.44,12.5 49.23,11.28 40.62,11.28 39.32,12.57 JP1.6 | v55.4,10.36 57.68,10.36 58.22,10.9 61.42,10.9 J3.3 | v36.5,4.65 35.59,3.73 35.59,1.68 UNO1.3V 34.75,1.52 33.53,2.74 31.77,2.74 30.63,1.6 UNO1.IOREF 29.26,2.74 27.43,2.74 25.76,1.07 20.57,1.07 18.14,3.5 14.48,3.5 D3.+ 14.33,3.58 v13.41,4.5 | v4.8,10.13 4.04,10.13 3.89,10.21
  Bottom 0.356: v23.24,44.12 23.85,43.51 23.85,42.29 J8.12 | U1.1 63.48,45.26 v63.48,37.34 63.4,37.19 63.4,12.88 61.49,10.97 J3.3 | v55.4,10.36 53.95,10.36 52.88,11.43 J4.3 | v36.5,4.65 49.45,4.65 50.44,5.64 51.74,5.64 52.81,4.57 J5.3 | v4.8,10.13 10.44,4.5 v13.41,4.5
VIN  (via drill 0.25)
  Top 0.356: v15.7,22.33 v16.61,23.24
  Bottom 0.356: v16.61,23.24 16.61,26.82 21.87,32.08 21.87,39.7 21.41,40.16 21.41,42.22 J8.13 | v15.7,22.33 15.7,20.27 32.38,3.58 43.66,3.58 UNO1.VIN

### Text on the board
tPlace: RST | PROG | D7 | D6 | 5V | Vin | Vcc | RST | D1-TX> | D0-RX< | A5-SCL | A4-SDA | D12-MISO | D13-SCK | D11-MOSI | R3Mkr12F MB | ARef | A0 | A1 | A2 | A3 | A4 | A5 | A6 | D0 | D1 | D2 | D3 | D4 | D5 | I2C | SPICAM | A01 | RX/TX
bPlace: c R3Mkr12F.tracker99.com